# EAGLE schematic Platine (EAGLE 9.2.1)

## Sheet 1 of 15: ARDUINO
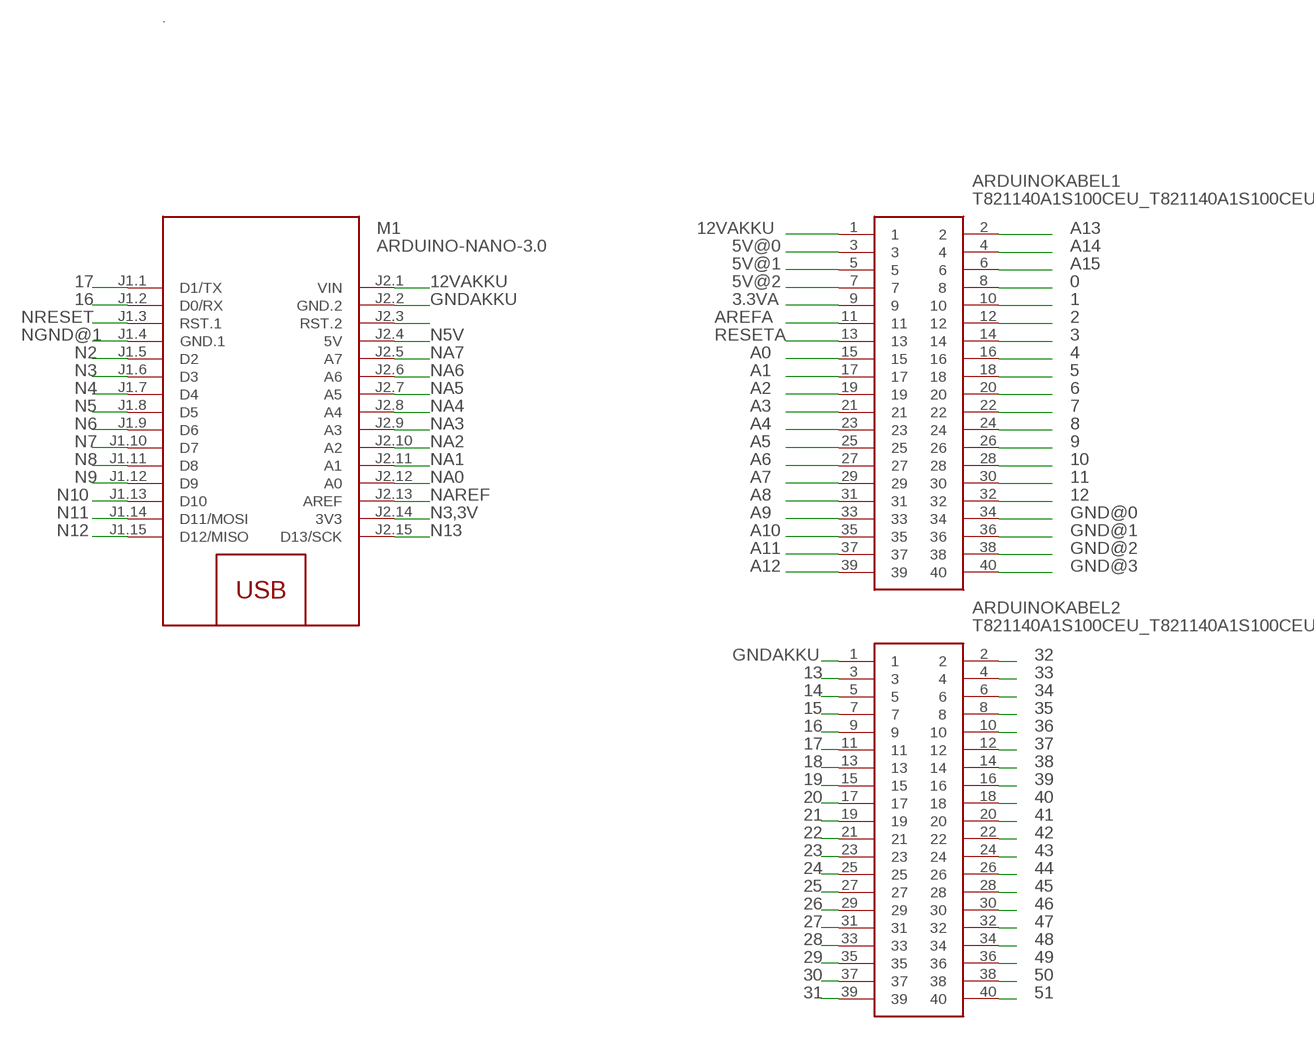
[diagram p0: schematic, sheet 1]

### Parts
ARDUINOKABEL1  T821140A1S100CEU_T821140A1S100CEU  [T821140A1S100CEU_SHDR40W64P254X254_2X20_5842X89]
ARDUINOKABEL2  T821140A1S100CEU_T821140A1S100CEU  [T821140A1S100CEU_SHDR40W64P254X254_2X20_5842X89]
M1  ARDUINO-NANO-3.0  [ARDUINO-NANO-3.0]

### Nets
0 [0.4A (low-power)]: ARDUINOKABEL1.8
1 [0.4A (low-power)]: ARDUINOKABEL1.10
2 [0.4A (low-power)]: ARDUINOKABEL1.12 ; also sheet 2
3 [0.4A (low-power)]: ARDUINOKABEL1.14 ; also sheet 2
3.3VA [0.4A (low-power)]: ARDUINOKABEL1.9
4 [0.4A (low-power)]: ARDUINOKABEL1.16 ; also sheet 2
5 [0.4A (low-power)]: ARDUINOKABEL1.18 ; also sheet 2
5V@0 [1A]: ARDUINOKABEL1.3 ; also sheet 2,3,4,5,6,7,8,9,10
5V@1 [1A]: ARDUINOKABEL1.5
5V@2 [1A]: ARDUINOKABEL1.7 ; also sheet 14
6: ARDUINOKABEL1.20 ; also sheet 2
7 [0.4A (low-power)]: ARDUINOKABEL1.22 ; also sheet 13
8 [0.4A (low-power)]: ARDUINOKABEL1.24 ; also sheet 2
9 [0.4A (low-power)]: ARDUINOKABEL1.26
10 [0.4A (low-power)]: ARDUINOKABEL1.28 ; also sheet 15
11 [0.4A (low-power)]: ARDUINOKABEL1.30 ; also sheet 15
12 [0.4A (low-power)]: ARDUINOKABEL1.32 ; also sheet 15
12VAKKU [2A]: ARDUINOKABEL1.1 M1.J2.1(VIN) ; also sheet 11
13 [0.4A (low-power)]: ARDUINOKABEL2.3 ; also sheet 15
14 [0.4A (low-power)]: ARDUINOKABEL2.5
15 [0.4A (low-power)]: ARDUINOKABEL2.7
16 [0.4A (low-power)]: ARDUINOKABEL2.9 M1.J1.2(D0/RX)
17 [0.4A (low-power)]: ARDUINOKABEL2.11 M1.J1.1(D1/TX)
18 [0.4A (low-power)]: ARDUINOKABEL2.13 ; also sheet 2
19 [0.4A (low-power)]: ARDUINOKABEL2.15 ; also sheet 2
20 [0.4A (low-power)]: ARDUINOKABEL2.17
21 [0.4A (low-power)]: ARDUINOKABEL2.19
22 [0.4A (low-power)]: ARDUINOKABEL2.21
23 [0.4A (low-power)]: ARDUINOKABEL2.23
24 [0.4A (low-power)]: ARDUINOKABEL2.25
25 [0.4A (low-power)]: ARDUINOKABEL2.27
26 [0.4A (low-power)]: ARDUINOKABEL2.29
27 [0.4A (low-power)]: ARDUINOKABEL2.31
28 [0.4A (low-power)]: ARDUINOKABEL2.33 ; also sheet 14
29 [0.4A (low-power)]: ARDUINOKABEL2.35 ; also sheet 14
30 [0.4A (low-power)]: ARDUINOKABEL2.37 ; also sheet 14
31: ARDUINOKABEL2.39 ; also sheet 14
32 [0.4A (low-power)]: ARDUINOKABEL2.2 ; also sheet 14
33 [0.4A (low-power)]: ARDUINOKABEL2.4 ; also sheet 14
34 [0.4A (low-power)]: ARDUINOKABEL2.6 ; also sheet 14
35 [0.4A (low-power)]: ARDUINOKABEL2.8 ; also sheet 14
36 [0.4A (low-power)]: ARDUINOKABEL2.10 ; also sheet 14
37 [0.4A (low-power)]: ARDUINOKABEL2.12 ; also sheet 14
38 [0.4A (low-power)]: ARDUINOKABEL2.14 ; also sheet 14
39 [7A]: ARDUINOKABEL2.16 ; also sheet 14
40 [0.4A (low-power)]: ARDUINOKABEL2.18 ; also sheet 14
41: ARDUINOKABEL2.20 ; also sheet 14
42 [0.4A (low-power)]: ARDUINOKABEL2.22 ; also sheet 14
43 [0.4A (low-power)]: ARDUINOKABEL2.24 ; also sheet 14
44: ARDUINOKABEL2.26 ; also sheet 14
45: ARDUINOKABEL2.28 ; also sheet 14
46 [0.4A (low-power)]: ARDUINOKABEL2.30 ; also sheet 14
47 [0.4A (low-power)]: ARDUINOKABEL2.32 ; also sheet 14
48 [0.4A (low-power)]: ARDUINOKABEL2.34
49 [0.4A (low-power)]: ARDUINOKABEL2.36
50 [0.4A (low-power)]: ARDUINOKABEL2.38
51 [0.4A (low-power)]: ARDUINOKABEL2.40
A0 [0.4A (low-power)]: ARDUINOKABEL1.15
A1 [0.4A (low-power)]: ARDUINOKABEL1.17
A2 [0.4A (low-power)]: ARDUINOKABEL1.19
A3 [0.4A (low-power)]: ARDUINOKABEL1.21
A4: ARDUINOKABEL1.23
A5 [0.4A (low-power)]: ARDUINOKABEL1.25
A6 [0.4A (low-power)]: ARDUINOKABEL1.27
A7 [0.4A (low-power)]: ARDUINOKABEL1.29
A8 [0.4A (low-power)]: ARDUINOKABEL1.31
A9 [0.4A (low-power)]: ARDUINOKABEL1.33
A10 [0.4A (low-power)]: ARDUINOKABEL1.35
A11 [0.4A (low-power)]: ARDUINOKABEL1.37
A12 [0.4A (low-power)]: ARDUINOKABEL1.39
A13: ARDUINOKABEL1.2
A14 [0.4A (low-power)]: ARDUINOKABEL1.4
A15 [0.4A (low-power)]: ARDUINOKABEL1.6
AREFA [0.4A (low-power)]: ARDUINOKABEL1.11
GND@0 [1A]: ARDUINOKABEL1.34 ; also sheet 2,3,4,5,6,7,8,9,10
GND@1 [1A]: ARDUINOKABEL1.36
GND@2 [1A]: ARDUINOKABEL1.38 ; also sheet 14,15
GND@3 [1A]: ARDUINOKABEL1.40
GNDAKKU [2A]: ARDUINOKABEL2.1 M1.J2.2(GND.2) ; also sheet 11
N2 [0.4A (low-power)]: M1.J1.5(D2) ; also sheet 3,4,5,6,7,8,9,10
N3 [0.4A (low-power)]: M1.J1.6(D3) ; also sheet 3,4,5,6,7,8,9,10
N3,3V [0.4A (low-power)]: M1.J2.14(3V3)
N4 [0.4A (low-power)]: M1.J1.7(D4) ; also sheet 3,4,5,6,7,8,9,10
N5: M1.J1.8(D5) ; also sheet 3
N5V [0.4A (low-power)]: M1.J2.4(5V)
N6 [0.4A (low-power)]: M1.J1.9(D6) ; also sheet 4
N7: M1.J1.10(D7) ; also sheet 5
N8 [0.4A (low-power)]: M1.J1.11(D8) ; also sheet 6
N9 [0.4A (low-power)]: M1.J1.12(D9) ; also sheet 7
N10 [0.4A (low-power)]: M1.J1.13(D10) ; also sheet 8
N11 [0.4A (low-power)]: M1.J1.14(D11/MOSI) ; also sheet 9
N12 [0.4A (low-power)]: M1.J1.15(D12/MISO) ; also sheet 10
N13 [0.4A (low-power)]: M1.J2.15(D13/SCK)
N$86: M1.J2.3(RST.2)
NA0 [0.4A (low-power)]: M1.J2.12(A0)
NA1: M1.J2.11(A1)
NA2 [0.4A (low-power)]: M1.J2.10(A2)
NA3 [0.4A (low-power)]: M1.J2.9(A3)
NA4 [0.4A (low-power)]: M1.J2.8(A4)
NA5 [0.4A (low-power)]: M1.J2.7(A5)
NA6 [0.4A (low-power)]: M1.J2.6(A6)
NA7 [0.4A (low-power)]: M1.J2.5(A7)
NAREF [0.4A (low-power)]: M1.J2.13(AREF)
NGND@1 [1A]: M1.J1.4(GND.1)
NRESET [0.4A (low-power)]: M1.J1.3(RST.1)
RESETA [0.4A (low-power)]: ARDUINOKABEL1.13

## Sheet 2 of 15: ULTRAS
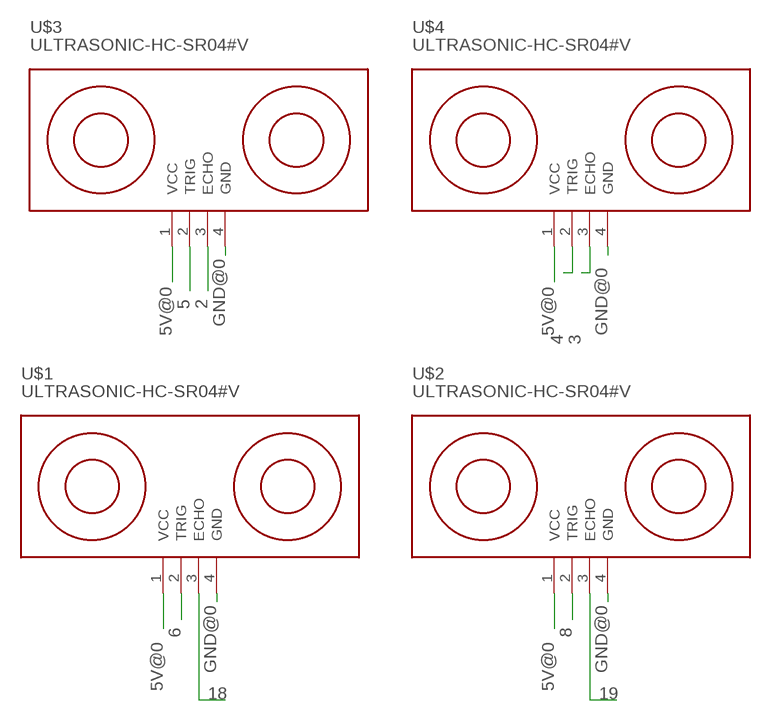
[diagram p1: schematic, sheet 2]

### Parts
U$1  ULTRASONIC-HC-SR04#V  [ULTRASONIC-HC-SR04#V]
U$2  ULTRASONIC-HC-SR04#V  [ULTRASONIC-HC-SR04#V]
U$3  ULTRASONIC-HC-SR04#V  [ULTRASONIC-HC-SR04#V]
U$4  ULTRASONIC-HC-SR04#V  [ULTRASONIC-HC-SR04#V]

### Nets
2 [0.4A (low-power)]: U$3.3(ECHO) ; also sheet 1
3 [0.4A (low-power)]: U$4.3(ECHO) ; also sheet 1
4 [0.4A (low-power)]: U$4.2(TRIG) ; also sheet 1
5 [0.4A (low-power)]: U$3.2(TRIG) ; also sheet 1
5V@0 [1A]: U$1.1(VCC) U$2.1(VCC) U$3.1(VCC) U$4.1(VCC) ; also sheet 1,3,4,5,6,7,8,9,10
6: U$1.2(TRIG) ; also sheet 1
8 [0.4A (low-power)]: U$2.2(TRIG) ; also sheet 1
18 [0.4A (low-power)]: U$1.3(ECHO) ; also sheet 1
19 [0.4A (low-power)]: U$2.3(ECHO) ; also sheet 1
GND@0 [1A]: U$1.4(GND) U$2.4(GND) U$3.4(GND) U$4.4(GND) ; also sheet 1,3,4,5,6,7,8,9,10

## Sheet 3 of 15: BOD1
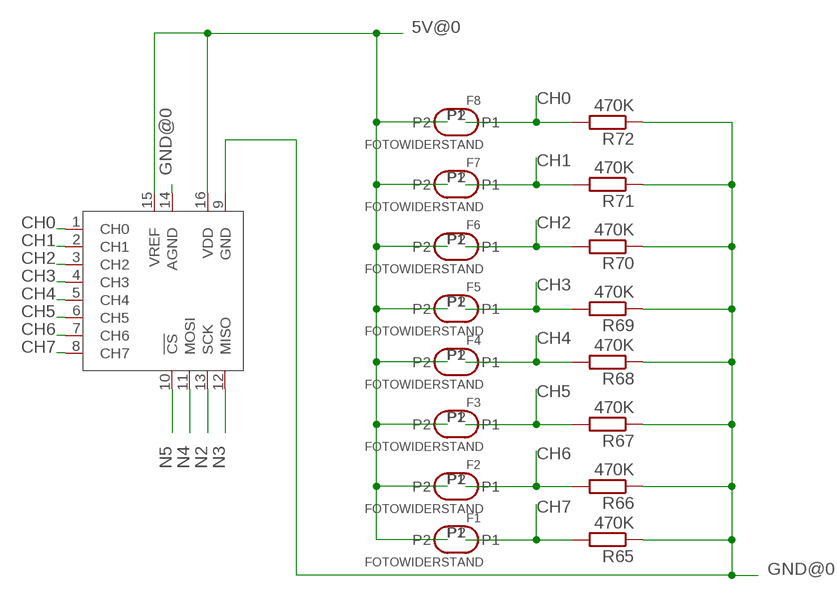
[diagram p2: schematic, sheet 3]

### Parts
F1  FOTOWIDERSTAND  [FOTOWIDERSTAND]
F2  FOTOWIDERSTAND  [FOTOWIDERSTAND]
F3  FOTOWIDERSTAND  [FOTOWIDERSTAND]
F4  FOTOWIDERSTAND  [FOTOWIDERSTAND]
F5  FOTOWIDERSTAND  [FOTOWIDERSTAND]
F6  FOTOWIDERSTAND  [FOTOWIDERSTAND]
F7  FOTOWIDERSTAND  [FOTOWIDERSTAND]
F8  FOTOWIDERSTAND  [FOTOWIDERSTAND]
R65  470K  R-EU_0207/7  [0207/7]
R66  470K  R-EU_0207/7  [0207/7]
R67  470K  R-EU_0207/7  [0207/7]
R68  470K  R-EU_0207/7  [0207/7]
R69  470K  R-EU_0207/7  [0207/7]
R70  470K  R-EU_0207/7  [0207/7]
R71  470K  R-EU_0207/7  [0207/7]
R72  470K  R-EU_0207/7  [0207/7]
U$6  MCP3008P  [DIL16]

### Nets
5V@0 [1A]: F1.P2 F2.P2 F3.P2 F4.P2 F5.P2 F6.P2 F7.P2 F8.P2 U$6.15(VREF) U$6.16(VDD) ; also sheet 1,2,4,5,6,7,8,9,10
CH0: F8.P1 R72.2 U$6.1(CH0)
CH1 [0.4A (low-power)]: F7.P1 R71.2 U$6.2(CH1)
CH2 [0.4A (low-power)]: F6.P1 R70.2 U$6.3(CH2)
CH3 [0.4A (low-power)]: F5.P1 R69.2 U$6.4(CH3)
CH4 [0.4A (low-power)]: F4.P1 R68.2 U$6.5(CH4)
CH5 [0.4A (low-power)]: F3.P1 R67.2 U$6.6(CH5)
CH6 [0.4A (low-power)]: F2.P1 R66.2 U$6.7(CH6)
CH7 [0.4A (low-power)]: F1.P1 R65.2 U$6.8(CH7)
GND@0 [1A]: R65.1 R66.1 R67.1 R68.1 R69.1 R70.1 R71.1 R72.1 U$6.9(GND) U$6.14(AGND) ; also sheet 1,2,4,5,6,7,8,9,10
N2 [0.4A (low-power)]: U$6.13(SCK) ; also sheet 1,4,5,6,7,8,9,10
N3 [0.4A (low-power)]: U$6.12(MISO) ; also sheet 1,4,5,6,7,8,9,10
N4 [0.4A (low-power)]: U$6.11(MOSI) ; also sheet 1,4,5,6,7,8,9,10
N5: U$6.10(!CS) ; also sheet 1

## Sheet 4 of 15: BOD2
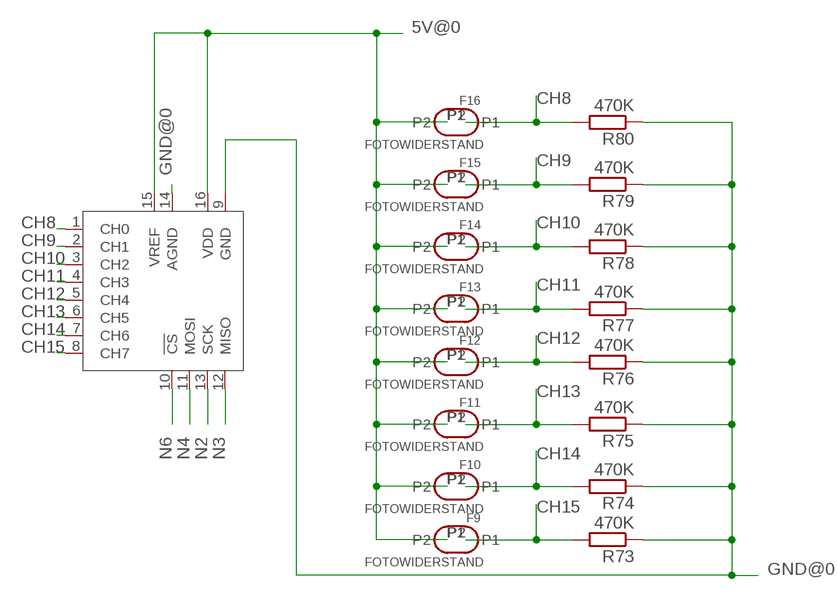
[diagram p3: schematic, sheet 4]

### Parts
F9  FOTOWIDERSTAND  [FOTOWIDERSTAND]
F10  FOTOWIDERSTAND  [FOTOWIDERSTAND]
F11  FOTOWIDERSTAND  [FOTOWIDERSTAND]
F12  FOTOWIDERSTAND  [FOTOWIDERSTAND]
F13  FOTOWIDERSTAND  [FOTOWIDERSTAND]
F14  FOTOWIDERSTAND  [FOTOWIDERSTAND]
F15  FOTOWIDERSTAND  [FOTOWIDERSTAND]
F16  FOTOWIDERSTAND  [FOTOWIDERSTAND]
R73  470K  R-EU_0207/7  [0207/7]
R74  470K  R-EU_0207/7  [0207/7]
R75  470K  R-EU_0207/7  [0207/7]
R76  470K  R-EU_0207/7  [0207/7]
R77  470K  R-EU_0207/7  [0207/7]
R78  470K  R-EU_0207/7  [0207/7]
R79  470K  R-EU_0207/7  [0207/7]
R80  470K  R-EU_0207/7  [0207/7]
U$7  MCP3008P  [DIL16]

### Nets
5V@0 [1A]: F9.P2 F10.P2 F11.P2 F12.P2 F13.P2 F14.P2 F15.P2 F16.P2 U$7.15(VREF) U$7.16(VDD) ; also sheet 1,2,3,5,6,7,8,9,10
CH8 [0.4A (low-power)]: F16.P1 R80.2 U$7.1(CH0)
CH9 [0.4A (low-power)]: F15.P1 R79.2 U$7.2(CH1)
CH10 [0.4A (low-power)]: F14.P1 R78.2 U$7.3(CH2)
CH11 [0.4A (low-power)]: F13.P1 R77.2 U$7.4(CH3)
CH12 [0.4A (low-power)]: F12.P1 R76.2 U$7.5(CH4)
CH13 [0.4A (low-power)]: F11.P1 R75.2 U$7.6(CH5)
CH14 [0.4A (low-power)]: F10.P1 R74.2 U$7.7(CH6)
CH15 [0.4A (low-power)]: F9.P1 R73.2 U$7.8(CH7)
GND@0 [1A]: R73.1 R74.1 R75.1 R76.1 R77.1 R78.1 R79.1 R80.1 U$7.9(GND) U$7.14(AGND) ; also sheet 1,2,3,5,6,7,8,9,10
N2 [0.4A (low-power)]: U$7.13(SCK) ; also sheet 1,3,5,6,7,8,9,10
N3 [0.4A (low-power)]: U$7.12(MISO) ; also sheet 1,3,5,6,7,8,9,10
N4 [0.4A (low-power)]: U$7.11(MOSI) ; also sheet 1,3,5,6,7,8,9,10
N6 [0.4A (low-power)]: U$7.10(!CS) ; also sheet 1

## Sheet 5 of 15: BOD3
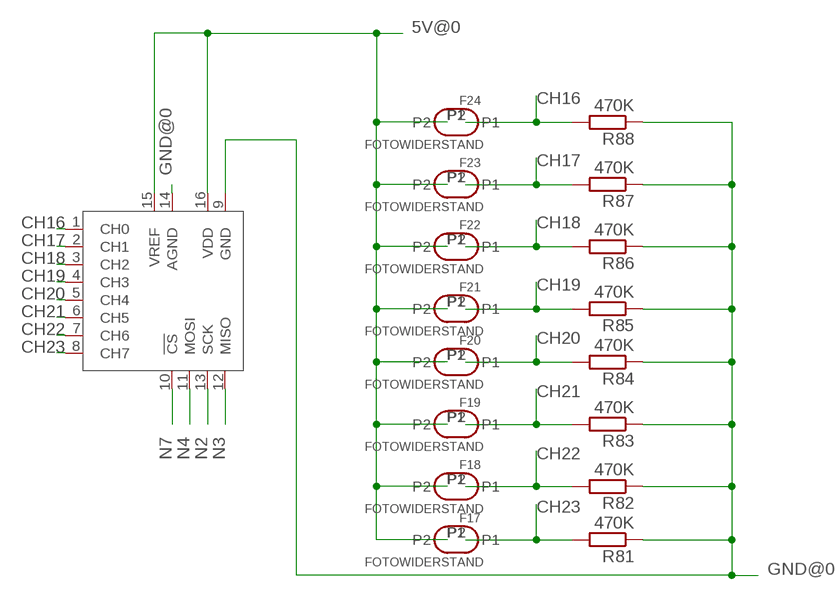
[diagram p4: schematic, sheet 5]

### Parts
F17  FOTOWIDERSTAND  [FOTOWIDERSTAND]
F18  FOTOWIDERSTAND  [FOTOWIDERSTAND]
F19  FOTOWIDERSTAND  [FOTOWIDERSTAND]
F20  FOTOWIDERSTAND  [FOTOWIDERSTAND]
F21  FOTOWIDERSTAND  [FOTOWIDERSTAND]
F22  FOTOWIDERSTAND  [FOTOWIDERSTAND]
F23  FOTOWIDERSTAND  [FOTOWIDERSTAND]
F24  FOTOWIDERSTAND  [FOTOWIDERSTAND]
R81  470K  R-EU_0207/7  [0207/7]
R82  470K  R-EU_0207/7  [0207/7]
R83  470K  R-EU_0207/7  [0207/7]
R84  470K  R-EU_0207/7  [0207/7]
R85  470K  R-EU_0207/7  [0207/7]
R86  470K  R-EU_0207/7  [0207/7]
R87  470K  R-EU_0207/7  [0207/7]
R88  470K  R-EU_0207/7  [0207/7]
U$8  MCP3008P  [DIL16]

### Nets
5V@0 [1A]: F17.P2 F18.P2 F19.P2 F20.P2 F21.P2 F22.P2 F23.P2 F24.P2 U$8.15(VREF) U$8.16(VDD) ; also sheet 1,2,3,4,6,7,8,9,10
CH16 [0.4A (low-power)]: F24.P1 R88.2 U$8.1(CH0)
CH17 [0.4A (low-power)]: F23.P1 R87.2 U$8.2(CH1)
CH18 [0.4A (low-power)]: F22.P1 R86.2 U$8.3(CH2)
CH19 [0.4A (low-power)]: F21.P1 R85.2 U$8.4(CH3)
CH20 [0.4A (low-power)]: F20.P1 R84.2 U$8.5(CH4)
CH21 [0.4A (low-power)]: F19.P1 R83.2 U$8.6(CH5)
CH22 [0.4A (low-power)]: F18.P1 R82.2 U$8.7(CH6)
CH23 [0.4A (low-power)]: F17.P1 R81.2 U$8.8(CH7)
GND@0 [1A]: R81.1 R82.1 R83.1 R84.1 R85.1 R86.1 R87.1 R88.1 U$8.9(GND) U$8.14(AGND) ; also sheet 1,2,3,4,6,7,8,9,10
N2 [0.4A (low-power)]: U$8.13(SCK) ; also sheet 1,3,4,6,7,8,9,10
N3 [0.4A (low-power)]: U$8.12(MISO) ; also sheet 1,3,4,6,7,8,9,10
N4 [0.4A (low-power)]: U$8.11(MOSI) ; also sheet 1,3,4,6,7,8,9,10
N7: U$8.10(!CS) ; also sheet 1

## Sheet 6 of 15: BOD4
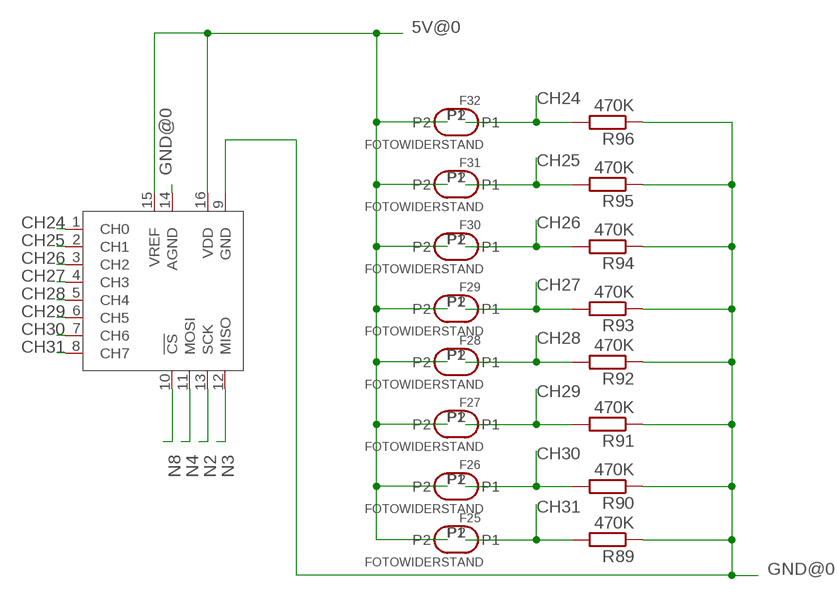
[diagram p5: schematic, sheet 6]

### Parts
F25  FOTOWIDERSTAND  [FOTOWIDERSTAND]
F26  FOTOWIDERSTAND  [FOTOWIDERSTAND]
F27  FOTOWIDERSTAND  [FOTOWIDERSTAND]
F28  FOTOWIDERSTAND  [FOTOWIDERSTAND]
F29  FOTOWIDERSTAND  [FOTOWIDERSTAND]
F30  FOTOWIDERSTAND  [FOTOWIDERSTAND]
F31  FOTOWIDERSTAND  [FOTOWIDERSTAND]
F32  FOTOWIDERSTAND  [FOTOWIDERSTAND]
R89  470K  R-EU_0207/7  [0207/7]
R90  470K  R-EU_0207/7  [0207/7]
R91  470K  R-EU_0207/7  [0207/7]
R92  470K  R-EU_0207/7  [0207/7]
R93  470K  R-EU_0207/7  [0207/7]
R94  470K  R-EU_0207/7  [0207/7]
R95  470K  R-EU_0207/7  [0207/7]
R96  470K  R-EU_0207/7  [0207/7]
U$10  MCP3008P  [DIL16]

### Nets
5V@0 [1A]: F25.P2 F26.P2 F27.P2 F28.P2 F29.P2 F30.P2 F31.P2 F32.P2 U$10.15(VREF) U$10.16(VDD) ; also sheet 1,2,3,4,5,7,8,9,10
CH24 [0.4A (low-power)]: F32.P1 R96.2 U$10.1(CH0)
CH25 [0.4A (low-power)]: F31.P1 R95.2 U$10.2(CH1)
CH26 [0.4A (low-power)]: F30.P1 R94.2 U$10.3(CH2)
CH27 [0.4A (low-power)]: F29.P1 R93.2 U$10.4(CH3)
CH28 [0.4A (low-power)]: F28.P1 R92.2 U$10.5(CH4)
CH29 [0.4A (low-power)]: F27.P1 R91.2 U$10.6(CH5)
CH30 [0.4A (low-power)]: F26.P1 R90.2 U$10.7(CH6)
CH31 [0.4A (low-power)]: F25.P1 R89.2 U$10.8(CH7)
GND@0 [1A]: R89.1 R90.1 R91.1 R92.1 R93.1 R94.1 R95.1 R96.1 U$10.9(GND) U$10.14(AGND) ; also sheet 1,2,3,4,5,7,8,9,10
N2 [0.4A (low-power)]: U$10.13(SCK) ; also sheet 1,3,4,5,7,8,9,10
N3 [0.4A (low-power)]: U$10.12(MISO) ; also sheet 1,3,4,5,7,8,9,10
N4 [0.4A (low-power)]: U$10.11(MOSI) ; also sheet 1,3,4,5,7,8,9,10
N8 [0.4A (low-power)]: U$10.10(!CS) ; also sheet 1

## Sheet 7 of 15: BOD5
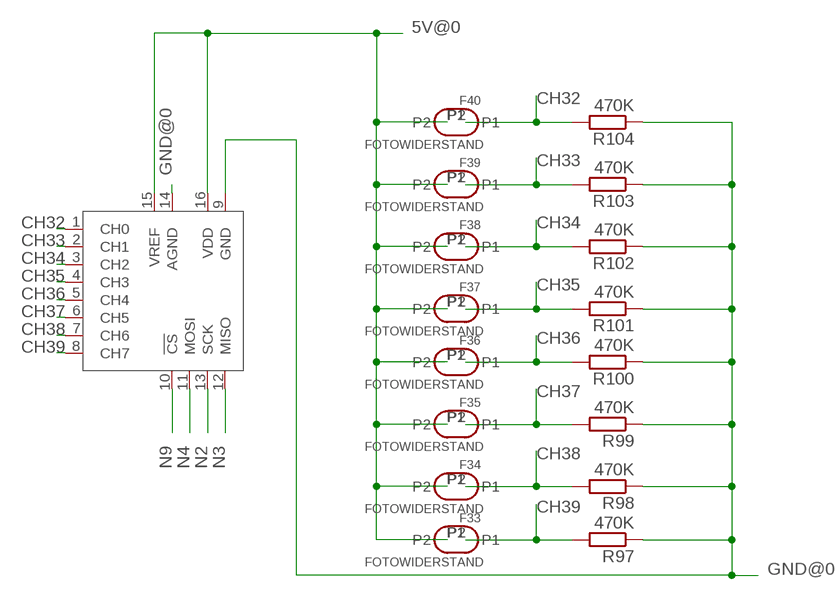
[diagram p6: schematic, sheet 7]

### Parts
F33  FOTOWIDERSTAND  [FOTOWIDERSTAND]
F34  FOTOWIDERSTAND  [FOTOWIDERSTAND]
F35  FOTOWIDERSTAND  [FOTOWIDERSTAND]
F36  FOTOWIDERSTAND  [FOTOWIDERSTAND]
F37  FOTOWIDERSTAND  [FOTOWIDERSTAND]
F38  FOTOWIDERSTAND  [FOTOWIDERSTAND]
F39  FOTOWIDERSTAND  [FOTOWIDERSTAND]
F40  FOTOWIDERSTAND  [FOTOWIDERSTAND]
R97  470K  R-EU_0207/7  [0207/7]
R98  470K  R-EU_0207/7  [0207/7]
R99  470K  R-EU_0207/7  [0207/7]
R100  470K  R-EU_0207/7  [0207/7]
R101  470K  R-EU_0207/7  [0207/7]
R102  470K  R-EU_0207/7  [0207/7]
R103  470K  R-EU_0207/7  [0207/7]
R104  470K  R-EU_0207/7  [0207/7]
U$11  MCP3008P  [DIL16]

### Nets
5V@0 [1A]: F33.P2 F34.P2 F35.P2 F36.P2 F37.P2 F38.P2 F39.P2 F40.P2 U$11.15(VREF) U$11.16(VDD) ; also sheet 1,2,3,4,5,6,8,9,10
CH32 [0.4A (low-power)]: F40.P1 R104.2 U$11.1(CH0)
CH33 [0.4A (low-power)]: F39.P1 R103.2 U$11.2(CH1)
CH34 [0.4A (low-power)]: F38.P1 R102.2 U$11.3(CH2)
CH35 [0.4A (low-power)]: F37.P1 R101.2 U$11.4(CH3)
CH36 [0.4A (low-power)]: F36.P1 R100.2 U$11.5(CH4)
CH37 [0.4A (low-power)]: F35.P1 R99.2 U$11.6(CH5)
CH38 [0.4A (low-power)]: F34.P1 R98.2 U$11.7(CH6)
CH39 [0.4A (low-power)]: F33.P1 R97.2 U$11.8(CH7)
GND@0 [1A]: R97.1 R98.1 R99.1 R100.1 R101.1 R102.1 R103.1 R104.1 U$11.9(GND) U$11.14(AGND) ; also sheet 1,2,3,4,5,6,8,9,10
N2 [0.4A (low-power)]: U$11.13(SCK) ; also sheet 1,3,4,5,6,8,9,10
N3 [0.4A (low-power)]: U$11.12(MISO) ; also sheet 1,3,4,5,6,8,9,10
N4 [0.4A (low-power)]: U$11.11(MOSI) ; also sheet 1,3,4,5,6,8,9,10
N9 [0.4A (low-power)]: U$11.10(!CS) ; also sheet 1

## Sheet 8 of 15: BOD6
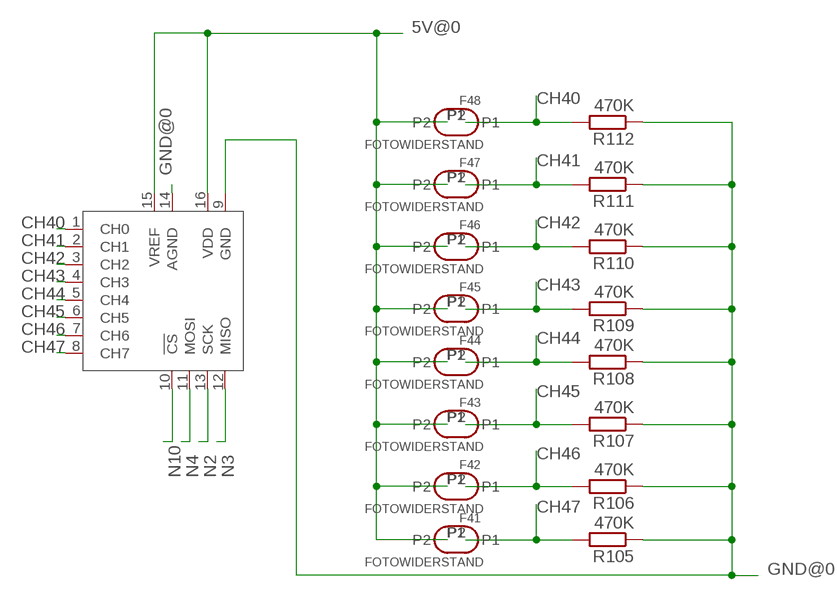
[diagram p7: schematic, sheet 8]

### Parts
F41  FOTOWIDERSTAND  [FOTOWIDERSTAND]
F42  FOTOWIDERSTAND  [FOTOWIDERSTAND]
F43  FOTOWIDERSTAND  [FOTOWIDERSTAND]
F44  FOTOWIDERSTAND  [FOTOWIDERSTAND]
F45  FOTOWIDERSTAND  [FOTOWIDERSTAND]
F46  FOTOWIDERSTAND  [FOTOWIDERSTAND]
F47  FOTOWIDERSTAND  [FOTOWIDERSTAND]
F48  FOTOWIDERSTAND  [FOTOWIDERSTAND]
R105  470K  R-EU_0207/7  [0207/7]
R106  470K  R-EU_0207/7  [0207/7]
R107  470K  R-EU_0207/7  [0207/7]
R108  470K  R-EU_0207/7  [0207/7]
R109  470K  R-EU_0207/7  [0207/7]
R110  470K  R-EU_0207/7  [0207/7]
R111  470K  R-EU_0207/7  [0207/7]
R112  470K  R-EU_0207/7  [0207/7]
U$12  MCP3008P  [DIL16]

### Nets
5V@0 [1A]: F41.P2 F42.P2 F43.P2 F44.P2 F45.P2 F46.P2 F47.P2 F48.P2 U$12.15(VREF) U$12.16(VDD) ; also sheet 1,2,3,4,5,6,7,9,10
CH40 [0.4A (low-power)]: F48.P1 R112.2 U$12.1(CH0)
CH41 [0.4A (low-power)]: F47.P1 R111.2 U$12.2(CH1)
CH42 [0.4A (low-power)]: F46.P1 R110.2 U$12.3(CH2)
CH43 [0.4A (low-power)]: F45.P1 R109.2 U$12.4(CH3)
CH44 [0.4A (low-power)]: F44.P1 R108.2 U$12.5(CH4)
CH45 [0.4A (low-power)]: F43.P1 R107.2 U$12.6(CH5)
CH46 [0.4A (low-power)]: F42.P1 R106.2 U$12.7(CH6)
CH47 [0.4A (low-power)]: F41.P1 R105.2 U$12.8(CH7)
GND@0 [1A]: R105.1 R106.1 R107.1 R108.1 R109.1 R110.1 R111.1 R112.1 U$12.9(GND) U$12.14(AGND) ; also sheet 1,2,3,4,5,6,7,9,10
N2 [0.4A (low-power)]: U$12.13(SCK) ; also sheet 1,3,4,5,6,7,9,10
N3 [0.4A (low-power)]: U$12.12(MISO) ; also sheet 1,3,4,5,6,7,9,10
N4 [0.4A (low-power)]: U$12.11(MOSI) ; also sheet 1,3,4,5,6,7,9,10
N10 [0.4A (low-power)]: U$12.10(!CS) ; also sheet 1

## Sheet 9 of 15: BOD7
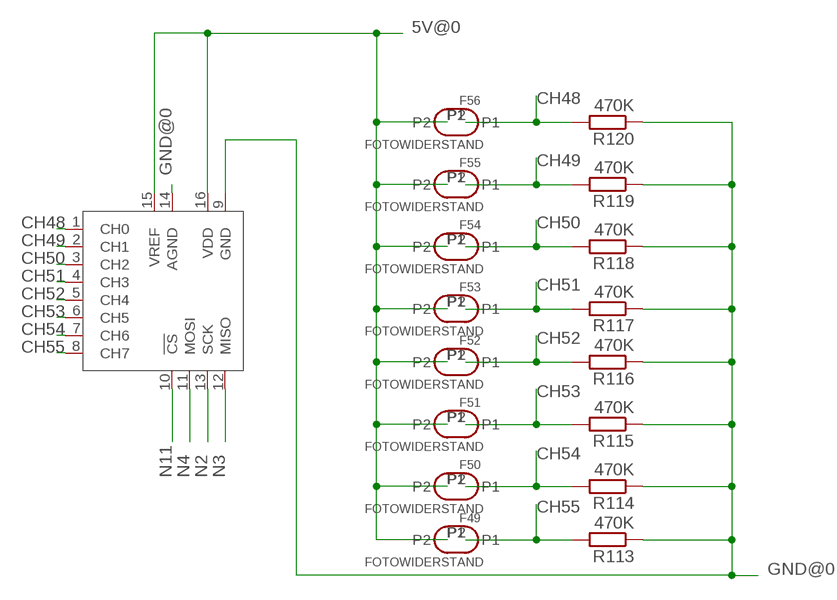
[diagram p8: schematic, sheet 9]

### Parts
F49  FOTOWIDERSTAND  [FOTOWIDERSTAND]
F50  FOTOWIDERSTAND  [FOTOWIDERSTAND]
F51  FOTOWIDERSTAND  [FOTOWIDERSTAND]
F52  FOTOWIDERSTAND  [FOTOWIDERSTAND]
F53  FOTOWIDERSTAND  [FOTOWIDERSTAND]
F54  FOTOWIDERSTAND  [FOTOWIDERSTAND]
F55  FOTOWIDERSTAND  [FOTOWIDERSTAND]
F56  FOTOWIDERSTAND  [FOTOWIDERSTAND]
R113  470K  R-EU_0207/7  [0207/7]
R114  470K  R-EU_0207/7  [0207/7]
R115  470K  R-EU_0207/7  [0207/7]
R116  470K  R-EU_0207/7  [0207/7]
R117  470K  R-EU_0207/7  [0207/7]
R118  470K  R-EU_0207/7  [0207/7]
R119  470K  R-EU_0207/7  [0207/7]
R120  470K  R-EU_0207/7  [0207/7]
U$13  MCP3008P  [DIL16]

### Nets
5V@0 [1A]: F49.P2 F50.P2 F51.P2 F52.P2 F53.P2 F54.P2 F55.P2 F56.P2 U$13.15(VREF) U$13.16(VDD) ; also sheet 1,2,3,4,5,6,7,8,10
CH48 [0.4A (low-power)]: F56.P1 R120.2 U$13.1(CH0)
CH49 [0.4A (low-power)]: F55.P1 R119.2 U$13.2(CH1)
CH50 [0.4A (low-power)]: F54.P1 R118.2 U$13.3(CH2)
CH51 [0.4A (low-power)]: F53.P1 R117.2 U$13.4(CH3)
CH52 [0.4A (low-power)]: F52.P1 R116.2 U$13.5(CH4)
CH53 [0.4A (low-power)]: F51.P1 R115.2 U$13.6(CH5)
CH54 [0.4A (low-power)]: F50.P1 R114.2 U$13.7(CH6)
CH55 [0.4A (low-power)]: F49.P1 R113.2 U$13.8(CH7)
GND@0 [1A]: R113.1 R114.1 R115.1 R116.1 R117.1 R118.1 R119.1 R120.1 U$13.9(GND) U$13.14(AGND) ; also sheet 1,2,3,4,5,6,7,8,10
N2 [0.4A (low-power)]: U$13.13(SCK) ; also sheet 1,3,4,5,6,7,8,10
N3 [0.4A (low-power)]: U$13.12(MISO) ; also sheet 1,3,4,5,6,7,8,10
N4 [0.4A (low-power)]: U$13.11(MOSI) ; also sheet 1,3,4,5,6,7,8,10
N11 [0.4A (low-power)]: U$13.10(!CS) ; also sheet 1

## Sheet 10 of 15: BOD8
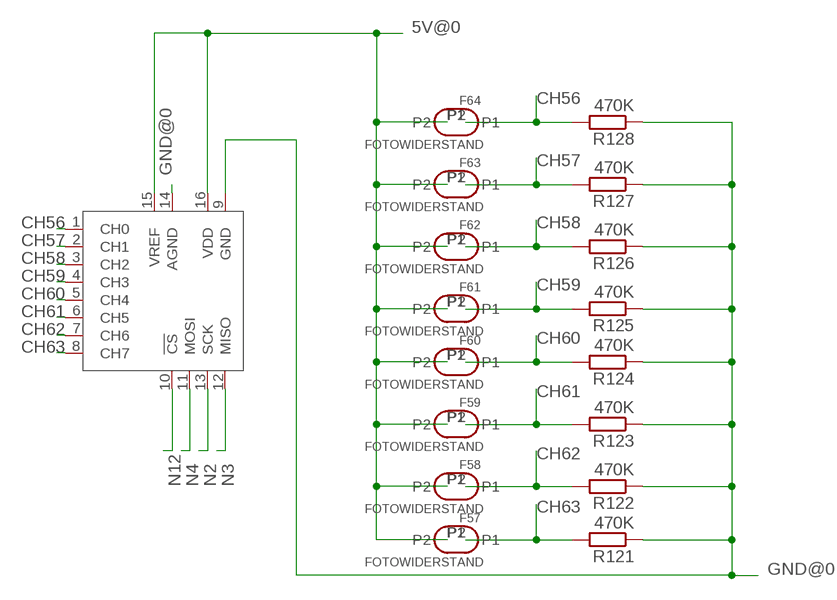
[diagram p9: schematic, sheet 10]

### Parts
F57  FOTOWIDERSTAND  [FOTOWIDERSTAND]
F58  FOTOWIDERSTAND  [FOTOWIDERSTAND]
F59  FOTOWIDERSTAND  [FOTOWIDERSTAND]
F60  FOTOWIDERSTAND  [FOTOWIDERSTAND]
F61  FOTOWIDERSTAND  [FOTOWIDERSTAND]
F62  FOTOWIDERSTAND  [FOTOWIDERSTAND]
F63  FOTOWIDERSTAND  [FOTOWIDERSTAND]
F64  FOTOWIDERSTAND  [FOTOWIDERSTAND]
R121  470K  R-EU_0207/7  [0207/7]
R122  470K  R-EU_0207/7  [0207/7]
R123  470K  R-EU_0207/7  [0207/7]
R124  470K  R-EU_0207/7  [0207/7]
R125  470K  R-EU_0207/7  [0207/7]
R126  470K  R-EU_0207/7  [0207/7]
R127  470K  R-EU_0207/7  [0207/7]
R128  470K  R-EU_0207/7  [0207/7]
U$14  MCP3008P  [DIL16]

### Nets
5V@0 [1A]: F57.P2 F58.P2 F59.P2 F60.P2 F61.P2 F62.P2 F63.P2 F64.P2 U$14.15(VREF) U$14.16(VDD) ; also sheet 1,2,3,4,5,6,7,8,9
CH56 [0.4A (low-power)]: F64.P1 R128.2 U$14.1(CH0)
CH57 [0.4A (low-power)]: F63.P1 R127.2 U$14.2(CH1)
CH58 [0.4A (low-power)]: F62.P1 R126.2 U$14.3(CH2)
CH59 [0.4A (low-power)]: F61.P1 R125.2 U$14.4(CH3)
CH60 [0.4A (low-power)]: F60.P1 R124.2 U$14.5(CH4)
CH61 [0.4A (low-power)]: F59.P1 R123.2 U$14.6(CH5)
CH62 [0.4A (low-power)]: F58.P1 R122.2 U$14.7(CH6)
CH63 [0.4A (low-power)]: F57.P1 R121.2 U$14.8(CH7)
GND@0 [1A]: R121.1 R122.1 R123.1 R124.1 R125.1 R126.1 R127.1 R128.1 U$14.9(GND) U$14.14(AGND) ; also sheet 1,2,3,4,5,6,7,8,9
N2 [0.4A (low-power)]: U$14.13(SCK) ; also sheet 1,3,4,5,6,7,8,9
N3 [0.4A (low-power)]: U$14.12(MISO) ; also sheet 1,3,4,5,6,7,8,9
N4 [0.4A (low-power)]: U$14.11(MOSI) ; also sheet 1,3,4,5,6,7,8,9
N12 [0.4A (low-power)]: U$14.10(!CS) ; also sheet 1

## Sheet 11 of 15: STROM
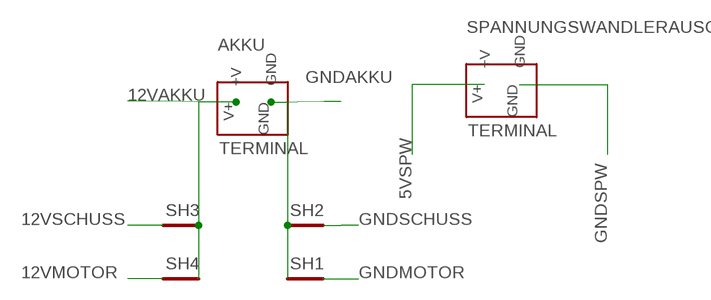
[diagram p10: schematic, sheet 11]

### Parts
AKKU  TERMINAL  [TERMINAL]
SH1  SHORT-HA5  [SHORT_ALL-50]
SH2  SHORT-HA5  [SHORT_ALL-50]
SH3  SHORT-HA5  [SHORT_ALL-50]
SH4  SHORT-HA5  [SHORT_ALL-50]
SPANNUNGSWANDLERAUSGANG  TERMINAL  [TERMINAL]

### Nets
5VSPW [2A]: SPANNUNGSWANDLERAUSGANG.V+(+V) ; also sheet 12
12VAKKU [2A]: AKKU.V+(+V) SH3.2 SH4.2 ; also sheet 1
12VMOTOR [7A]: SH4.1 ; also sheet 14
12VSCHUSS [10A]: SH3.1 ; also sheet 13
GNDAKKU [2A]: AKKU.GND SH1.1 SH2.1 ; also sheet 1
GNDMOTOR [7A]: SH1.2 ; also sheet 14
GNDSCHUSS [10A]: SH2.2 ; also sheet 13
GNDSPW [2A]: SPANNUNGSWANDLERAUSGANG.GND ; also sheet 12

## Sheet 12 of 15: LEDs
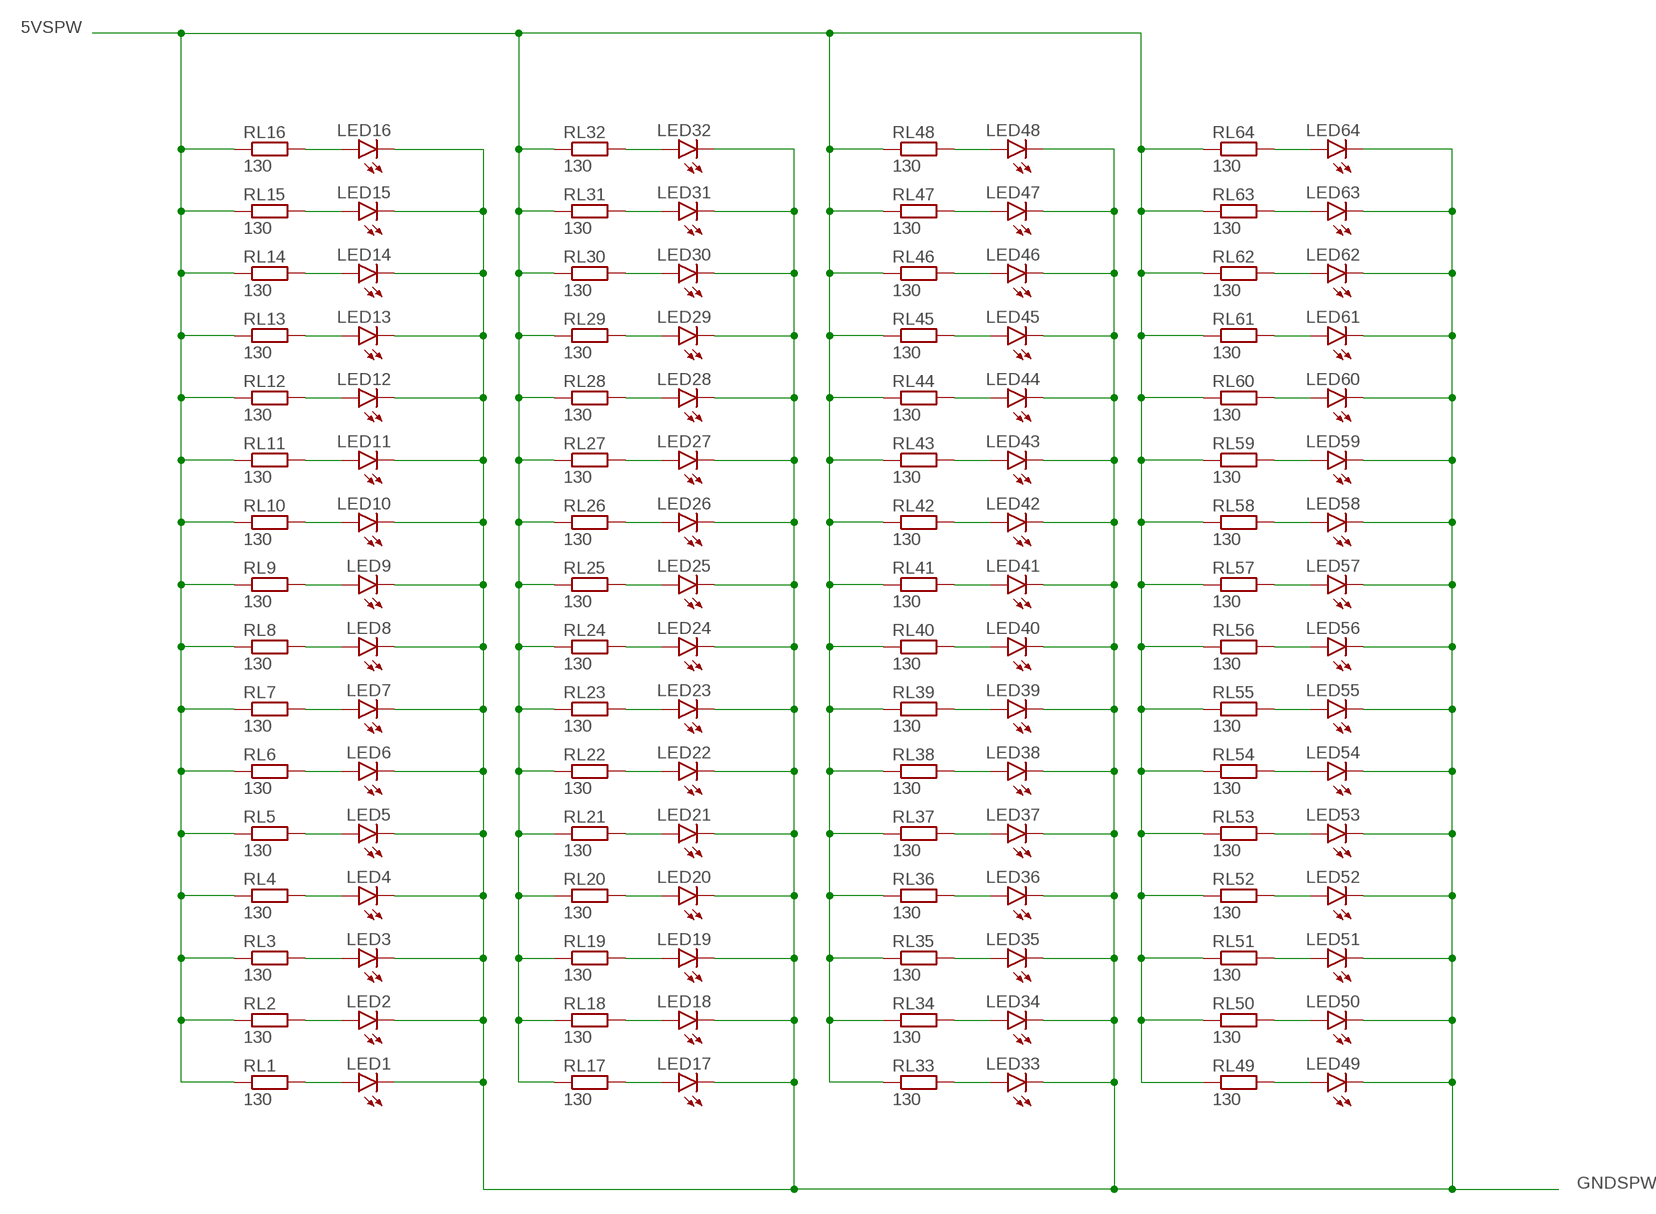
[diagram p11: schematic, sheet 12]

### Parts
LED1  LEDLED3MM2  [3MM]
LED2  LEDLED3MM2  [3MM]
LED3  LEDLED3MM2  [3MM]
LED4  LEDLED3MM2  [3MM]
LED5  LEDLED3MM2  [3MM]
LED6  LEDLED3MM2  [3MM]
LED7  LEDLED3MM2  [3MM]
LED8  LEDLED3MM2  [3MM]
LED9  LEDLED3MM2  [3MM]
LED10  LEDLED3MM2  [3MM]
LED11  LEDLED3MM2  [3MM]
LED12  LEDLED3MM2  [3MM]
LED13  LEDLED3MM2  [3MM]
LED14  LEDLED3MM2  [3MM]
LED15  LEDLED3MM2  [3MM]
LED16  LEDLED3MM2  [3MM]
LED17  LEDLED3MM2  [3MM]
LED18  LEDLED3MM2  [3MM]
LED19  LEDLED3MM2  [3MM]
LED20  LEDLED3MM2  [3MM]
LED21  LEDLED3MM2  [3MM]
LED22  LEDLED3MM2  [3MM]
LED23  LEDLED3MM2  [3MM]
LED24  LEDLED3MM2  [3MM]
LED25  LEDLED3MM2  [3MM]
LED26  LEDLED3MM2  [3MM]
LED27  LEDLED3MM2  [3MM]
LED28  LEDLED3MM2  [3MM]
LED29  LEDLED3MM2  [3MM]
LED30  LEDLED3MM2  [3MM]
LED31  LEDLED3MM2  [3MM]
LED32  LEDLED3MM2  [3MM]
LED33  LEDLED3MM2  [3MM]
LED34  LEDLED3MM2  [3MM]
LED35  LEDLED3MM2  [3MM]
LED36  LEDLED3MM2  [3MM]
LED37  LEDLED3MM2  [3MM]
LED38  LEDLED3MM2  [3MM]
LED39  LEDLED3MM2  [3MM]
LED40  LEDLED3MM2  [3MM]
LED41  LEDLED3MM2  [3MM]
LED42  LEDLED3MM2  [3MM]
LED43  LEDLED3MM2  [3MM]
LED44  LEDLED3MM2  [3MM]
LED45  LEDLED3MM2  [3MM]
LED46  LEDLED3MM2  [3MM]
LED47  LEDLED3MM2  [3MM]
LED48  LEDLED3MM2  [3MM]
LED49  LEDLED3MM2  [3MM]
LED50  LEDLED3MM2  [3MM]
LED51  LEDLED3MM2  [3MM]
LED52  LEDLED3MM2  [3MM]
LED53  LEDLED3MM2  [3MM]
LED54  LEDLED3MM2  [3MM]
LED55  LEDLED3MM2  [3MM]
LED56  LEDLED3MM2  [3MM]
LED57  LEDLED3MM2  [3MM]
LED58  LEDLED3MM2  [3MM]
LED59  LEDLED3MM2  [3MM]
LED60  LEDLED3MM2  [3MM]
LED61  LEDLED3MM2  [3MM]
LED62  LEDLED3MM2  [3MM]
LED63  LEDLED3MM2  [3MM]
LED64  LEDLED3MM2  [3MM]
RL1  130  R-EU_0207/7  [0207/7]
RL2  130  R-EU_0207/7  [0207/7]
RL3  130  R-EU_0207/7  [0207/7]
RL4  130  R-EU_0207/7  [0207/7]
RL5  130  R-EU_0207/7  [0207/7]
RL6  130  R-EU_0207/7  [0207/7]
RL7  130  R-EU_0207/7  [0207/7]
RL8  130  R-EU_0207/7  [0207/7]
RL9  130  R-EU_0207/7  [0207/7]
RL10  130  R-EU_0207/7  [0207/7]
RL11  130  R-EU_0207/7  [0207/7]
RL12  130  R-EU_0207/7  [0207/7]
RL13  130  R-EU_0207/7  [0207/7]
RL14  130  R-EU_0207/7  [0207/7]
RL15  130  R-EU_0207/7  [0207/7]
RL16  130  R-EU_0207/7  [0207/7]
RL17  130  R-EU_0207/7  [0207/7]
RL18  130  R-EU_0207/7  [0207/7]
RL19  130  R-EU_0207/7  [0207/7]
RL20  130  R-EU_0207/7  [0207/7]
RL21  130  R-EU_0207/7  [0207/7]
RL22  130  R-EU_0207/7  [0207/7]
RL23  130  R-EU_0207/7  [0207/7]
RL24  130  R-EU_0207/7  [0207/7]
RL25  130  R-EU_0207/7  [0207/7]
RL26  130  R-EU_0207/7  [0207/7]
RL27  130  R-EU_0207/7  [0207/7]
RL28  130  R-EU_0207/7  [0207/7]
RL29  130  R-EU_0207/7  [0207/7]
RL30  130  R-EU_0207/7  [0207/7]
RL31  130  R-EU_0207/7  [0207/7]
RL32  130  R-EU_0207/7  [0207/7]
RL33  130  R-EU_0207/7  [0207/7]
RL34  130  R-EU_0207/7  [0207/7]
RL35  130  R-EU_0207/7  [0207/7]
RL36  130  R-EU_0207/7  [0207/7]
RL37  130  R-EU_0207/7  [0207/7]
RL38  130  R-EU_0207/7  [0207/7]
RL39  130  R-EU_0207/7  [0207/7]
RL40  130  R-EU_0207/7  [0207/7]
RL41  130  R-EU_0207/7  [0207/7]
RL42  130  R-EU_0207/7  [0207/7]
RL43  130  R-EU_0207/7  [0207/7]
RL44  130  R-EU_0207/7  [0207/7]
RL45  130  R-EU_0207/7  [0207/7]
RL46  130  R-EU_0207/7  [0207/7]
RL47  130  R-EU_0207/7  [0207/7]
RL48  130  R-EU_0207/7  [0207/7]
RL49  130  R-EU_0207/7  [0207/7]
RL50  130  R-EU_0207/7  [0207/7]
RL51  130  R-EU_0207/7  [0207/7]
RL52  130  R-EU_0207/7  [0207/7]
RL53  130  R-EU_0207/7  [0207/7]
RL54  130  R-EU_0207/7  [0207/7]
RL55  130  R-EU_0207/7  [0207/7]
RL56  130  R-EU_0207/7  [0207/7]
RL57  130  R-EU_0207/7  [0207/7]
RL58  130  R-EU_0207/7  [0207/7]
RL59  130  R-EU_0207/7  [0207/7]
RL60  130  R-EU_0207/7  [0207/7]
RL61  130  R-EU_0207/7  [0207/7]
RL62  130  R-EU_0207/7  [0207/7]
RL63  130  R-EU_0207/7  [0207/7]
RL64  130  R-EU_0207/7  [0207/7]

### Nets
5VSPW [2A]: RL1.1 RL2.1 RL3.1 RL4.1 RL5.1 RL6.1 RL7.1 RL8.1 RL9.1 RL10.1 RL11.1 RL12.1 RL13.1 RL14.1 RL15.1 RL16.1 RL17.1 RL18.1 RL19.1 RL20.1 RL21.1 RL22.1 RL23.1 RL24.1 RL25.1 RL26.1 RL27.1 RL28.1 RL29.1 RL30.1 RL31.1 RL32.1 RL33.1 RL34.1 RL35.1 RL36.1 RL37.1 RL38.1 RL39.1 RL40.1 RL41.1 RL42.1 RL43.1 RL44.1 RL45.1 RL46.1 RL47.1 RL48.1 RL49.1 RL50.1 RL51.1 RL52.1 RL53.1 RL54.1 RL55.1 RL56.1 RL57.1 RL58.1 RL59.1 RL60.1 RL61.1 RL62.1 RL63.1 RL64.1 ; also sheet 11
GNDSPW [2A]: LED1.K(C) LED2.K(C) LED3.K(C) LED4.K(C) LED5.K(C) LED6.K(C) LED7.K(C) LED8.K(C) LED9.K(C) LED10.K(C) LED11.K(C) LED12.K(C) LED13.K(C) LED14.K(C) LED15.K(C) LED16.K(C) LED17.K(C) LED18.K(C) LED19.K(C) LED20.K(C) LED21.K(C) LED22.K(C) LED23.K(C) LED24.K(C) LED25.K(C) LED26.K(C) LED27.K(C) LED28.K(C) LED29.K(C) LED30.K(C) LED31.K(C) LED32.K(C) LED33.K(C) LED34.K(C) LED35.K(C) LED36.K(C) LED37.K(C) LED38.K(C) LED39.K(C) LED40.K(C) LED41.K(C) LED42.K(C) LED43.K(C) LED44.K(C) LED45.K(C) LED46.K(C) LED47.K(C) LED48.K(C) LED49.K(C) LED50.K(C) LED51.K(C) LED52.K(C) LED53.K(C) LED54.K(C) LED55.K(C) LED56.K(C) LED57.K(C) LED58.K(C) LED59.K(C) LED60.K(C) LED61.K(C) LED62.K(C) LED63.K(C) LED64.K(C) ; also sheet 11
N$2: LED4.A RL4.2
N$3: LED3.A RL3.2
N$4: LED2.A RL2.2
N$5: LED1.A RL1.2
N$6: LED8.A RL8.2
N$7: LED7.A RL7.2
N$8: LED6.A RL6.2
N$9: LED5.A RL5.2
N$11: LED12.A RL12.2
N$12: LED11.A RL11.2
N$13: LED10.A RL10.2
N$14: LED9.A RL9.2
N$15: LED16.A RL16.2
N$16: LED15.A RL15.2
N$17: LED14.A RL14.2
N$18: LED13.A RL13.2
N$19: LED20.A RL20.2
N$20: LED19.A RL19.2
N$21: LED18.A RL18.2
N$22: LED17.A RL17.2
N$23: LED24.A RL24.2
N$24: LED23.A RL23.2
N$25: LED22.A RL22.2
N$26: LED21.A RL21.2
N$27: LED28.A RL28.2
N$28: LED27.A RL27.2
N$29: LED26.A RL26.2
N$30: LED25.A RL25.2
N$31: LED32.A RL32.2
N$32: LED31.A RL31.2
N$33: LED30.A RL30.2
N$34: LED29.A RL29.2
N$35: LED36.A RL36.2
N$36: LED35.A RL35.2
N$37: LED34.A RL34.2
N$38: LED33.A RL33.2
N$39: LED40.A RL40.2
N$40: LED39.A RL39.2
N$41: LED38.A RL38.2
N$42: LED37.A RL37.2
N$43: LED44.A RL44.2
N$44: LED43.A RL43.2
N$45: LED42.A RL42.2
N$46: LED41.A RL41.2
N$47: LED48.A RL48.2
N$48: LED47.A RL47.2
N$49: LED46.A RL46.2
N$50: LED45.A RL45.2
N$51: LED52.A RL52.2
N$52: LED51.A RL51.2
N$53: LED50.A RL50.2
N$54: LED49.A RL49.2
N$55: LED56.A RL56.2
N$56: LED55.A RL55.2
N$57: LED54.A RL54.2
N$58: LED53.A RL53.2
N$59: LED60.A RL60.2
N$60: LED59.A RL59.2
N$61: LED58.A RL58.2
N$62: LED57.A RL57.2
N$63: LED64.A RL64.2
N$64: LED63.A RL63.2
N$65: LED62.A RL62.2
N$66: LED61.A RL61.2

## Sheet 13 of 15: SCHUSS
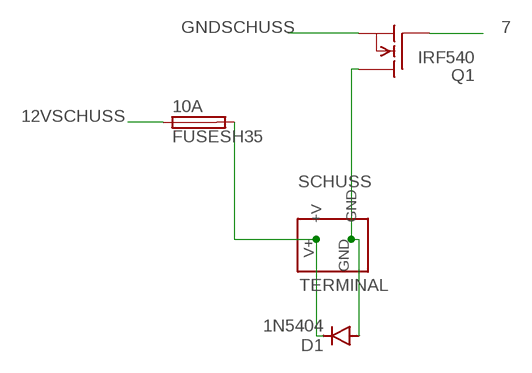
[diagram p12: schematic, sheet 13]

### Parts
10A  FUSESH35  [SH25]
D1  1N5404  1N5400  [DO201-15]
Q1  IRF540  [TO220]
SCHUSS  TERMINAL  [TERMINAL]

### Nets
7 [0.4A (low-power)]: Q1.1(G) ; also sheet 1
12VSCHUSS [10A]: 10A.1 ; also sheet 11
GNDSCHUSS [10A]: Q1.3(S) ; also sheet 11
N$67: D1.A Q1.2(D) SCHUSS.GND
N$68: 10A.2 D1.C SCHUSS.V+(+V)

## Sheet 14 of 15: MOTOR
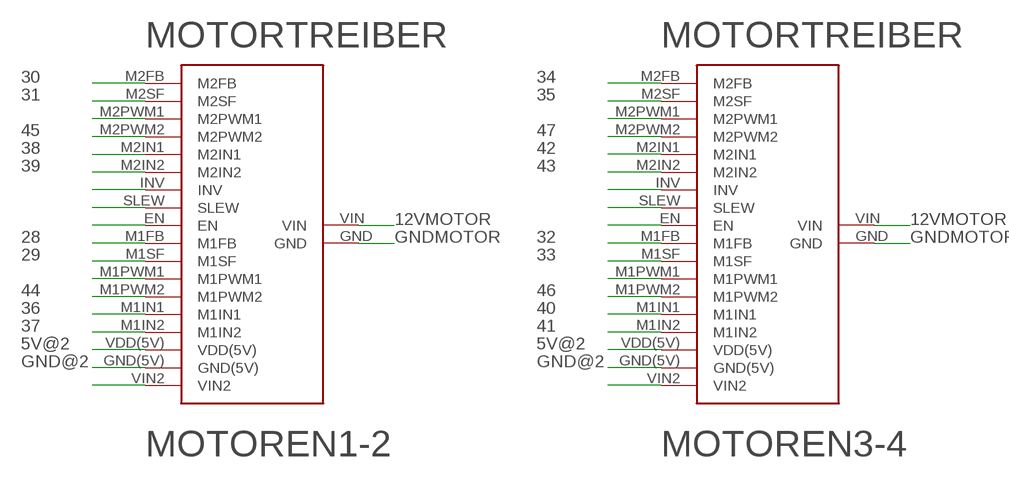
[diagram p13: schematic, sheet 14]

### Parts
MOTOREN1-2  MOTORTREIBER  [MOTORTREIBER]
MOTOREN3-4  MOTORTREIBER  [MOTORTREIBER]

### Nets
5V@2 [1A]: MOTOREN1-2.VDD(5V) MOTOREN3-4.VDD(5V) ; also sheet 1
12VMOTOR [7A]: MOTOREN1-2.VIN MOTOREN3-4.VIN ; also sheet 11
28 [0.4A (low-power)]: MOTOREN1-2.M1FB ; also sheet 1
29 [0.4A (low-power)]: MOTOREN1-2.M1SF ; also sheet 1
30 [0.4A (low-power)]: MOTOREN1-2.M2FB ; also sheet 1
31: MOTOREN1-2.M2SF ; also sheet 1
32 [0.4A (low-power)]: MOTOREN3-4.M1FB ; also sheet 1
33 [0.4A (low-power)]: MOTOREN3-4.M1SF ; also sheet 1
34 [0.4A (low-power)]: MOTOREN3-4.M2FB ; also sheet 1
35 [0.4A (low-power)]: MOTOREN3-4.M2SF ; also sheet 1
36 [0.4A (low-power)]: MOTOREN1-2.M1IN1 ; also sheet 1
37 [0.4A (low-power)]: MOTOREN1-2.M1IN2 ; also sheet 1
38 [0.4A (low-power)]: MOTOREN1-2.M2IN1 ; also sheet 1
39 [7A]: MOTOREN1-2.M2IN2 ; also sheet 1
40 [0.4A (low-power)]: MOTOREN3-4.M1IN1 ; also sheet 1
41: MOTOREN3-4.M1IN2 ; also sheet 1
42 [0.4A (low-power)]: MOTOREN3-4.M2IN1 ; also sheet 1
43 [0.4A (low-power)]: MOTOREN3-4.M2IN2 ; also sheet 1
44: MOTOREN1-2.M1PWM2 ; also sheet 1
45: MOTOREN1-2.M2PWM2 ; also sheet 1
46 [0.4A (low-power)]: MOTOREN3-4.M1PWM2 ; also sheet 1
47 [0.4A (low-power)]: MOTOREN3-4.M2PWM2 ; also sheet 1
GND@2 [1A]: MOTOREN1-2.GND(5V) MOTOREN3-4.GND(5V) ; also sheet 1,15
GNDMOTOR [7A]: MOTOREN1-2.GND MOTOREN3-4.GND ; also sheet 11
N$70: MOTOREN1-2.M2PWM1
N$74: MOTOREN1-2.INV
N$75: MOTOREN1-2.SLEW
N$76: MOTOREN1-2.EN
N$79: MOTOREN1-2.M1PWM1
N$85: MOTOREN1-2.VIN2
N$89: MOTOREN3-4.M2PWM1
N$93: MOTOREN3-4.INV
N$94: MOTOREN3-4.SLEW
N$95: MOTOREN3-4.EN
N$98: MOTOREN3-4.M1PWM1
N$104: MOTOREN3-4.VIN2

## Sheet 15 of 15: SCHALTER
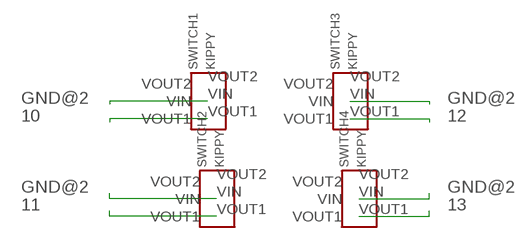
[diagram p14: schematic, sheet 15]

### Parts
SWITCH1  KIPPY  [KIPPY]
SWITCH2  KIPPY  [KIPPY]
SWITCH3  KIPPY  [KIPPY]
SWITCH4  KIPPY  [KIPPY]

### Nets
10 [0.4A (low-power)]: SWITCH1.VOUT1 ; also sheet 1
11 [0.4A (low-power)]: SWITCH2.VOUT1 ; also sheet 1
12 [0.4A (low-power)]: SWITCH3.VOUT1 ; also sheet 1
13 [0.4A (low-power)]: SWITCH4.VOUT1 ; also sheet 1
GND@2 [1A]: SWITCH1.VIN SWITCH2.VIN SWITCH3.VIN SWITCH4.VIN ; also sheet 1,14
Unconnected: SWITCH1.VOUT2 SWITCH2.VOUT2 SWITCH3.VOUT2 SWITCH4.VOUT2

## Library data of the parts
10A = fuse:FUSE: Fuse; OC_FARNELL: unknown; OC_NEWARK: unknown
AKKU SCHUSS SPANNUNGSWANDLERAUSGANG = BörningComponents:TERMINAL
ARDUINOKABEL1 ARDUINOKABEL2 = BörningComponents:T821140A1S100CEU_T821140A1S100CEU: AMPHENOL - T821140A1S100CEU - HEADER, VERTICAL, 2.54MM, 40WAY Source: Datasheet <http://www.farnell.com/datasheets/1648843.pdf>; ARROW_PART_NUMBER: T821140A1S100CEU; DESCRIPTION: AMPHENOL - T821140A1S100CEU - HEADER, VERTICAL, 2.54MM, 40WAY; HEIGHT: 9.15mm; MANUFACTURER_NAME: Amphenol; MANUFACTURER_PART_NUMBER: T821140A1S100CEU
D1 = diode:1N5400: DIODE standard rectifier, 3 A, 50 V (Motorola)
F1-F64 = BörningComponents:FOTOWIDERSTAND
LED1-LED10 LED12-LED64 = BörningComponents:LED: LED OSRAM: - CHIPLED LG R971, LG N971, LY N971, LG Q971, LY Q971, LO R971, LY R971 LH N974, LH R974 LS Q976, LO Q976, LY Q976 LO Q996 - Hyper CHIPLED LW Q18S LB Q993, LB Q99A, LB R99A - SideLED LS A670, LO A670, LY A670, LG A670, LP A670 LB A673, LV A673, LT A673, LW A673 LH A674 LY A675 LS A676, LA A676, LO A676, LY A676, LW A676 LS A679, LY A679, LG A679 - Hyper Micro SIDELED® LS Y876, LA Y876, LO Y876, LY Y876 LT Y87S - SmartLED LW L88C, LW L88S LB L89C, LB L89S, LG L890 LS L89K, LO L89K, LY L89K LS L896, LA L896, LO L896, LY L896 - TOPLED LS T670, LO T670, LY T670, LG T670, LP T670 LSG T670, LSP T670, LSY T670, LOP T670, LYG T670 LG T671, LOG T671, LSG T671 LB T673, LV T673, LT T673, LW T673 LH T674 LS T676, LA T676, LO T676, LY T676, LB T676, LH T676, LSB T676, LW T676 LB T67C, LV T67C, LT T67C, LS T67K, LO T67K, LY T67K, LW E67C LS E67B, LA E67B, LO E67B, LY E67B, LB E67C, LV E67C, LT E67C LW T67C LS T679, LY T679, LG T679 LS T770, LO T770, LY T770, LG T770, LP T770 LB T773, LV T773, LT T773, LW T773 LH T774 LS E675, LA E675, LY E675, LS T675 LS T776, LA T776, LO T776, LY T776, LB T776 LHGB T686 LT T68C, LB T68C - Hyper Mini TOPLED® LB M676 - Mini TOPLED Santana® LG M470 LS M47K, LO M47K, LY M47K Source: http://www.osram.convergy.de LUXEON: - LUMILED® LXK2-PW12-R00, LXK2-PW12-S00, LXK2-PW14-U00, LXK2-PW14-V00 LXK2-PM12-R00, LXK2-PM12-S00, LXK2-PM14-U00 LXK2-PE12-Q00, LXK2-PE12-R00, LXK2-PE12-S00, LXK2-PE14-T00, LXK2-PE14-U00 LXK2-PB12-K00, LXK2-PB12-L00, LXK2-PB12-M00, LXK2-PB14-N00, LXK2-PB14-P00, LXK2-PB14-Q00 LXK2-PR12-L00, LXK2-PR12-M00, LXK2-PR14-Q00, LXK2-PR14-R00 LXK2-PD12-Q00, LXK2-PD12-R00, LXK2-PD12-S00 LXK2-PH12-R00, LXK2-PH12-S00 LXK2-PL12-P00, LXK2-PL12-Q00, LXK2-PL12-R00 Source: www.luxeon.com KINGBRIGHT: KA-3528ASYC Source: www.kingbright.com
LED11 = BörningComponents:LED: LED OSRAM: - CHIPLED LG R971, LG N971, LY N971, LG Q971, LY Q971, LO R971, LY R971 LH N974, LH R974 LS Q976, LO Q976, LY Q976 LO Q996 - Hyper CHIPLED LW Q18S LB Q993, LB Q99A, LB R99A - SideLED LS A670, LO A670, LY A670, LG A670, LP A670 LB A673, LV A673, LT A673, LW A673 LH A674 LY A675 LS A676, LA A676, LO A676, LY A676, LW A676 LS A679, LY A679, LG A679 - Hyper Micro SIDELED® LS Y876, LA Y876, LO Y876, LY Y876 LT Y87S - SmartLED LW L88C, LW L88S LB L89C, LB L89S, LG L890 LS L89K, LO L89K, LY L89K LS L896, LA L896, LO L896, LY L896 - TOPLED LS T670, LO T670, LY T670, LG T670, LP T670 LSG T670, LSP T670, LSY T670, LOP T670, LYG T670 LG T671, LOG T671, LSG T671 LB T673, LV T673, LT T673, LW T673 LH T674 LS T676, LA T676, LO T676, LY T676, LB T676, LH T676, LSB T676, LW T676 LB T67C, LV T67C, LT T67C, LS T67K, LO T67K, LY T67K, LW E67C LS E67B, LA E67B, LO E67B, LY E67B, LB E67C, LV E67C, LT E67C LW T67C LS T679, LY T679, LG T679 LS T770, LO T770, LY T770, LG T770, LP T770 LB T773, LV T773, LT T773, LW T773 LH T774 LS E675, LA E675, LY E675, LS T675 LS T776, LA T776, LO T776, LY T776, LB T776 LHGB T686 LT T68C, LB T68C - Hyper Mini TOPLED® LB M676 - Mini TOPLED Santana® LG M470 LS M47K, LO M47K, LY M47K Source: http://www.osram.convergy.de LUXEON: - LUMILED® LXK2-PW12-R00, LXK2-PW12-S00, LXK2-PW14-U00, LXK2-PW14-V00 LXK2-PM12-R00, LXK2-PM12-S00, LXK2-PM14-U00 LXK2-PE12-Q00, LXK2-PE12-R00, LXK2-PE12-S00, LXK2-PE14-T00, LXK2-PE14-U00 LXK2-PB12-K00, LXK2-PB12-L00, LXK2-PB12-M00, LXK2-PB14-N00, LXK2-PB14-P00, LXK2-PB14-Q00 LXK2-PR12-L00, LXK2-PR12-M00, LXK2-PR14-Q00, LXK2-PR14-R00 LXK2-PD12-Q00, LXK2-PD12-R00, LXK2-PD12-S00 LXK2-PH12-R00, LXK2-PH12-S00 LXK2-PL12-P00, LXK2-PL12-Q00, LXK2-PL12-R00 Source: www.luxeon.com KINGBRIGHT: KA-3528ASYC Source: www.kingbright.com; SPICEPREFIX: L
M1 = BörningComponents:ARDUINO-NANO-3.0: Arduino Nano 3.0 and compatible devices More details available here: https://www.arduino.cc/en/Main/ArduinoBoardNano Click here to find device on ebay.com <http://www.ebay.com/sch/arduino+nano>
MOTOREN1-2 MOTOREN3-4 = BörningComponents:MOTORTREIBER
Q1 = transistor-fet:IRF540: N-Channel Enhancement MOSFET (HEXFET); 100V; 28A; 0,077Ohm
R65-R128 RL1-RL64 = BörningComponents:R-EU_: RESISTOR, European symbol
SH1-SH4 = shorts-old:SHORT-H: Short between two nets; BOM: no
SWITCH1-SWITCH4 = BörningComponents:KIPPY
U$1-U$4 = diy-modules:ULTRASONIC-HC-SR04: Ultrasonic Ranging Module HC-SR04 More details available here: http://randomnerdtutorials.com/complete-guide-for-ultrasonic-sensor-hc-sr04/ Click here to find device on ebay.com <http://www.ebay.com/sch/hc+sr04+ultrasonic>
U$6-U$8 U$10-U$14 = BörningComponents:MCP3008

## Net classes
0 default: clearance 0.205 mm
1 0.7A: width 0.2 mm, clearance 0.1 mm
2 1A: width 0.3 mm, clearance 0.205 mm to class 0, clearance 0.205 mm to class 1, clearance 0.205 mm
3 2A: width 0.8 mm, clearance 0.205 mm to class 0, clearance 0.205 mm to class 1, clearance 0.205 mm to class 2, clearance 0.205 mm
4 3A: width 1.4 mm, clearance 0.15 mm
5 7A: width 5 mm, clearance 0.205 mm to class 0, clearance 0.205 mm to class 1, clearance 0.205 mm to class 2, clearance 0.205 mm to class 3, clearance 0.205 mm to class 4, clearance 0.205 mm
6 0.4A (low-power): width 0.1 mm, clearance 0.205 mm to class 0, clearance 0.205 mm to class 1, clearance 0.205 mm to class 2, clearance 0.205 mm to class 3, clearance 0.205 mm to class 4, clearance 0.205 mm to class 5, clearance 0.205 mm
7 10A: width 6.5 mm, clearance 0.205 mm to class 0, clearance 0.205 mm to class 1, clearance 0.205 mm to class 2, clearance 0.205 mm to class 3, clearance 0.205 mm to class 4, clearance 0.205 mm to class 5, clearance 0.205 mm to class 6, clearance 0.3 mm